# Altium project H05R1.PrjPcb (part 2 of 2)

## Sheet H05R1_Frontend_1.SchDoc
size Letter; CompanyName: Hexabitz; DocumentNumber: 3; SheetNumber: 2; SheetTotal: 3
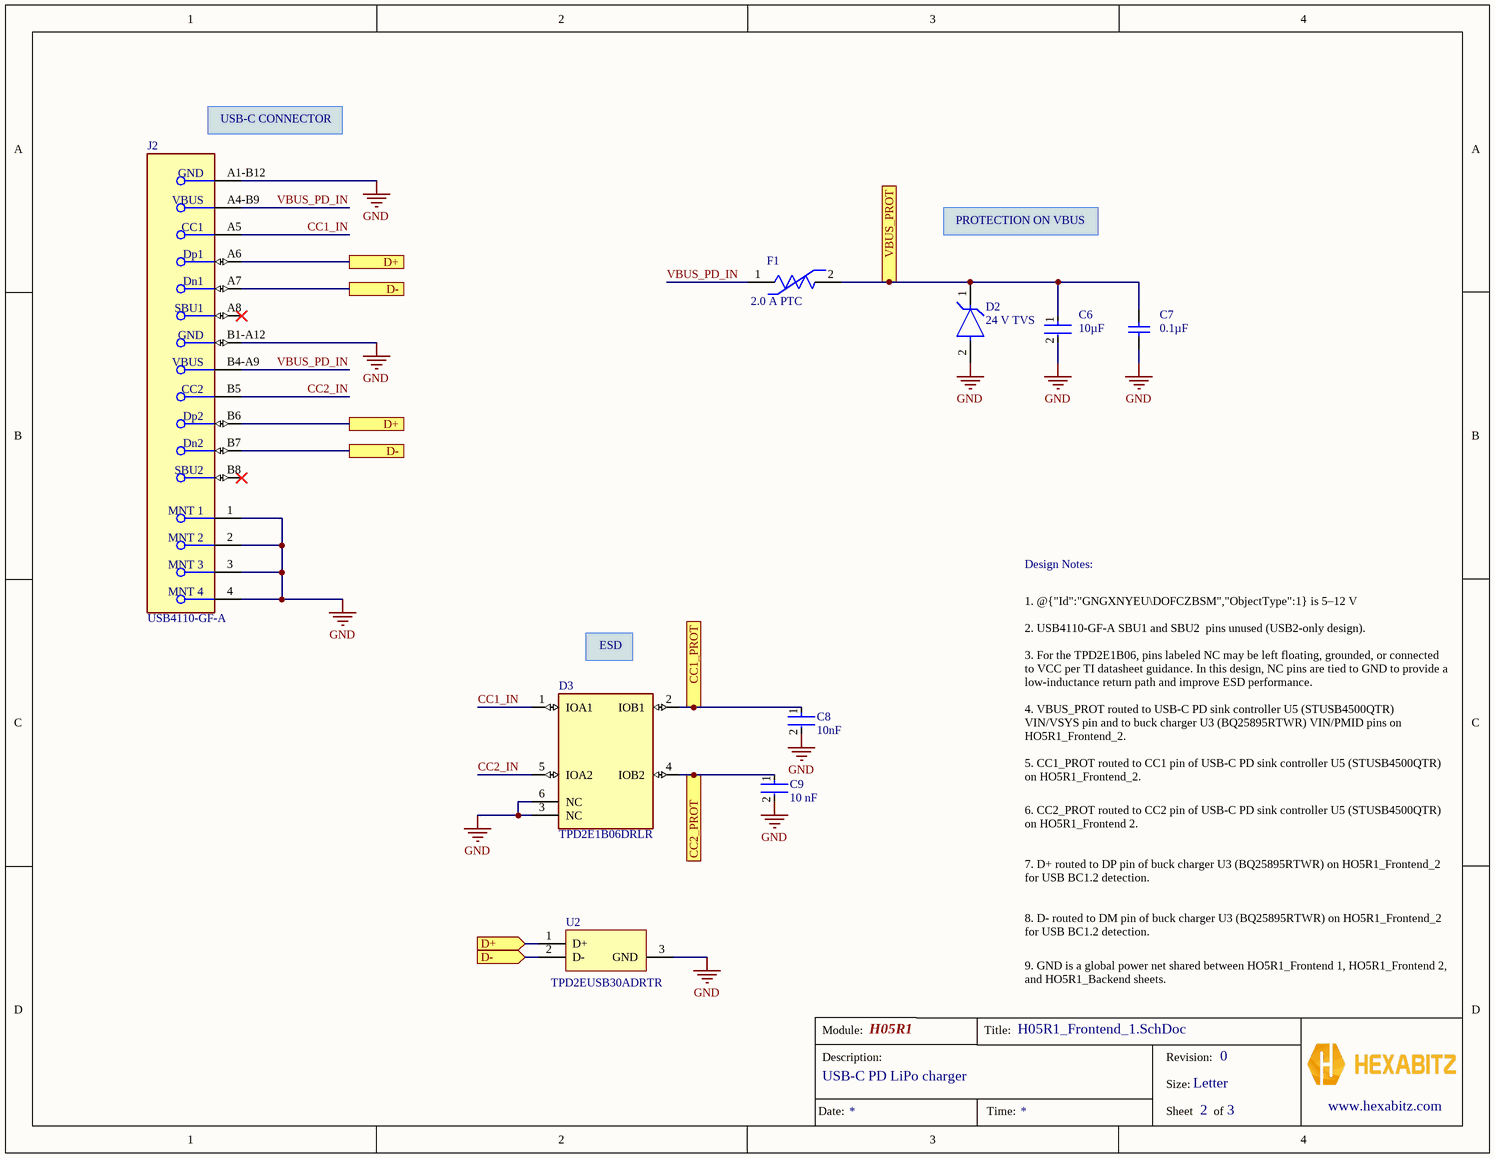
[diagram p1: H05R1_Frontend_1.SchDoc]

### Parts
C6  10µF  [FP-GRM32-MFG]
C7  0.1µF  [CAPC1608X90X35ML10T15]
C8  10nF  [FP-GRM155-0_05-IPC_C]
C9  10 nF  [FP-GRM155-0_05-IPC_C]
D2  24 V TVS  [FP-SMBJ-MFG]
D3  TPD2E1B06DRLR  [FP-DRL0006A-MFG]
F1  2.0 A PTC  [FP-0ZCF0200AF2C-MFG]
J2  USB4110-GF-A  [FP-USB4110-GF-A-MFG]
U2  TPD2EUSB30ADRTR  [DRT0003A]

### Ports
CC1_PROT, CC2_PROT, D+, D+ (in), D-, D- (in), VBUS_PROT

### Nets
GND: C6.2 C7.1 C8.2 C9.2 D2.2(A) D3.3(NC) D3.6(NC) J2.1(MNT_1) J2.2(MNT_2) J2.3(MNT_3) J2.4(MNT_4) J2.A1-B12(GND) J2.B1-A12(GND) U2.3(GND)  [project net PGND]
CC1_IN: D3.1(IOA1) J2.A5(CC1)
CC2_IN: D3.5(IOA2) J2.B5(CC2)
VBUS_PD_IN: F1.1 J2.A4-B9(VBUS) J2.B4-A9(VBUS)
NetC6_1: C6.1 C7.2 D2.1(C) F1.2 ; port VBUS_PROT
NetC8_1: C8.1 D3.2(IOB1) ; port CC1_PROT
NetC9_1: C9.1 D3.4(IOB2) ; port CC2_PROT
NetJ2_A6: J2.A6(Dp1) J2.B6(Dp2) U2.1(D+) ; port D+
NetJ2_A7: J2.A7(Dn1) J2.B7(Dn2) U2.2(D-) ; port D-

Not connected (* = marked no-connect by the designer): J2 A8(SBU1)* B8(SBU2)*

### Notes on the sheet
- USB-C CONNECTOR
- PROTECTION ON VBUS
- Design Notes:
- 2. USB4110-GF-A SBU1 and SBU2  pins unused (USB2-only design).
- 1. @{"Id":"GNGXNYEU\DOFCZBSM","ObjectType":1} is 5–12 V from USB-C PD source.
- ESD
- 3. For the TPD2E1B06, pins labeled NC may be left floating, grounded, or connected to VCC per TI datasheet guidance. In this design, NC pins are tied to GND to provide a low-inductance return path and improve ESD performance.
- 4. VBUS_PROT routed to USB-C PD sink controller U5 (STUSB4500QTR) VIN/VSYS pin and to buck charger U3 (BQ25895RTWR) VIN/PMID pins on HO5R1_Frontend_2.
- 5. CC1_PROT routed to CC1 pin of USB-C PD sink controller U5 (STUSB4500QTR) on HO5R1_Frontend_2.
- 6. CC2_PROT routed to CC2 pin of USB-C PD sink controller U5 (STUSB4500QTR) on HO5R1_Frontend 2.
- 7. D+ routed to DP pin of buck charger U3 (BQ25895RTWR) on HO5R1_Frontend_2 for USB BC1.2 detection.
- 8. D- routed to DM pin of buck charger U3 (BQ25895RTWR) on HO5R1_Frontend_2 for USB BC1.2 detection.
- 9. GND is a global power net shared between HO5R1_Frontend 1, HO5R1_Frontend 2, and HO5R1_Backend sheets.
- Module:
- Title:
- Description:
- Size:
- Revision:
- Letter
- www.hexabitz.com
- Date:
- Time:
- Sheet
- of

### Library data of the parts
C6 = CMP-2000-05261-2: CAP CER 10UF 50V X7R 1210; Manufacturer Part Number: GRM32ER71H106KA12L; Manufacturer: Murata; Tolerance: 10%; Material: Ceramic; Temperature Coefficient: 15%; Voltage Rating: 50V; Temperature Characteristic: X7R; Value: 10uF; ComponentLink2Description: Datasheet; Device Class L1: Passive Components; Lead Free: Yes; Temperature Range High: +125°C; Category: Cap; ComponentLink2URL: https://search.murata.co.jp/Ceramy/image/img/A01X/G101/ENG/GRM32ER71H106KA12-01.pdf; Device Class L2: Capacitors; Package: GRM32; Mouser Description: 1210 10 uF 50 V ±10% Tolerance X7R SMT Multilayer Ceramic Capacitor; Capacitance: 10uF; Octopart: https://octopart.com/grm32er71h106ka12l-murata-10470987; Digikey Description: CAP CER 10UF 50V X7R 1210; Height: 2.7mm; Temperature: -55°C to +125°C; Temperature Range Low: -55°C; RoHS: TRUE; Device Class L3: Ceramic Capacitors; Automotive: No; MPN: *; Octopartt: https://octopart.com/grm32er71h106ka12l-murata-10470987
C7 = CMP-2100-03643-1: Chip Capacitor, 0.1 uF, +/- 10%, 50 V, -55 to 125 degC, 0603 (1608 Metric), RoHS, Tape and Reel; Manufacturer: Murata; Dielectric Material: Ceramic; Voltage Rating: 50V; Capacitance: 100nF; Dielectric: X7R; Insulation Resistance: 10GR; Case Code (Metric): 1608; Lead Free: LeadFree; Depth: 0.8mm; Number of Pins: 2; Radiation Hardening: No; Case/Package: 0603; Manufacturer URL: http://www.murata.com/; Packaging: TapeandReel; Length: 1.6mm; Contact Plating: Tin; Datasheet URL: http://psearch.en.murata.com/capacitor/product/GRM188R71H104KA93%23.pdf; Tolerance: 10%; Case Code (Imperial): 0603; Min Operating Temperature: -55degC; RoHSCompliant: true; Voltage: 50V; Termination: SMD/SMT; Mount: SurfaceMount; Material: Ceramic; Package Quantity: 1; Height: 0.8mm; Thickness: 0.035inch; REACH SVHC: NoSVHC; Max Operating Temperature: 125degC; Width: 0.8mm; Package Reference: 0603; Voltage Rating (DC): 50V; Datasheet Version: 42675.0; Package Description: 2-Pin Surface Mount Device, Body 1.6 x 0.8 mm; Octopart: https://octopart.com/part/murata/GRM188R71H104KA93D
C8 = CMP-2008-04637-5: Chip Multilayer Ceramic Capacitors for General Purpose, 0402, 10000pF, X7R, 15%, 10%, 50V; Voltage: 25V; MFN: Murata; Parameter 1: GRM155R71H103KA88D; Tolerance: 10%; Mount: Surface Mount; Lead Free: Lead Free; Radiation Hardening: No; Case Code (Imperial): 0402; REACH SVHC: No SVHC; Case/Package: 0402; Dielectric: X7R; Voltage Rating (DC): 50V; Max Operating Temperature: 125°C; Termination: SMD/SMT; Material: Ceramic; Width: 0.02inch; Package Quantity: 1; Voltage Rating: 50V; Thickness: 0.022inch; Packaging: Tape and Reel; Height: 0.5mm; Number of Pins: 2; Case Code (Metric): 1005; Min Operating Temperature: -55°C; Length: 1mm; Capacitance: 10nF; Depth: 0.5mm; Octopart: https://octopart.com/part/murata/GRM155R71H103KA88D
C9 = CMP-2008-04637-5: Chip Multilayer Ceramic Capacitors for General Purpose, 0402, 10000pF, X7R, 15%, 10%, 50V; MPN: GRM155R71H103KA88D; Voltage: 25V; Capacitance: 10nF; MFN: Murata; Tolerance: 10%; Mount: Surface Mount; Lead Free: Lead Free; Radiation Hardening: No; Case Code (Imperial): 0402; REACH SVHC: No SVHC; Case/Package: 0402; Dielectric: X7R; Voltage Rating (DC): 50V; Max Operating Temperature: 125°C; Termination: SMD/SMT; Material: Ceramic; Width: 0.02inch; Package Quantity: 1; Voltage Rating: 50V; Thickness: 0.022inch; Packaging: Tape and Reel; Height: 0.5mm; Number of Pins: 2; Case Code (Metric): 1005; Min Operating Temperature: -55°C; Length: 1mm; Depth: 0.5mm; Octopart: https://octopart.com/part/murata/GRM155R71H103KA88D
D2 = CMP-07401-000035-1: TVS DIODE 24V 38.9V SMB; MPN: SMBJ24A; Max Breakdown Voltage: 30.7V; Operating Supply Voltage: 3.5V; Min Breakdown Voltage: 26.7V; Test Current: 1mA; Direction: Unidirectional; Peak Pulse Current: 15.4A; Peak Pulse Power: 600W; Number of Unidirectional Channels: 1; Element Configuration: Single; Power Line Protection: No; Diode Type: ZENER; Leakage Current: 5uA; Max Surge Current: 100A; ESD Protection: Yes; MFN: Bourns; Width: 3.94mm; Number of Pins: 2; Clamping Voltage: 38.9V; Reverse Standoff Voltage: 24V; Breakdown Voltage: 30.7V; RoHS Compliant: Yes; Package Quantity: 1; Case/Package: SMB; Mount: Surface Mount; Resistor Type: Zener; Packaging: Tape and Reel; Reverse Breakdown Voltage: 26.7V; Series: SMBJ; Radiation Hardening: No; Max Operating Temperature: 150°C; Termination: SMD/SMT; Number of Channels: 1; Length: 4.57mm; REACH SVHC: No SVHC; Number of Elements: 1; Polarity: Unidirectional; Height: 2.42mm; Max Power Dissipation: 600W; Max Reverse Leakage Current: 5uA; Min Operating Temperature: -55°C; ComponentLink1Description: Octopart; ComponentLink1URL: https://octopart-clicks.com/click/altium?manufacturer=Bourns&mpn=SMBJ24A&country=US&channel=Vault+Part+Catalog&ref=man&; Octopart: https://octopart.com/smbj24a-bourns-12809467
D3 = CMP-04985-000003-1: TVS DIODE 5.5V 15V 6SOT; Manufacturer: Texas Instruments; Peak Pulse Power: 35W; Peak Pulse Current: 2.5A; Direction: Bidirectional; Standoff Height: 0mm; Interface: I2C,USB,LVDS,Other; Number Of Channels: 2; Breakdown Voltage: 7V; Ambient Temperature Range High: +125°C; Package: DRL0006A; Automotive: No; Lead Free: Yes; Temperature Range Low: -40°C; Reverse Standoff Voltage: 5.5V; Clamping Voltage: 15V; Mouser Description: ESD Suppressors / TVS Diodes 2-CH system level ESD protect device; Temperature Range High: +125°C; Device Class L1: Circuit Protection; ComponentLink2Description: Datasheet; RoHS: TRUE; Ambient Temperature Range Low: -40°C; Height: 0.6mm; Device Class L3: unset; Device Class L2: ESD and Circuit Protection ICs; Temperature: -40°C to +125°C; Octopart: https://octopart.com/tpd2e1b06drlr-texas+instruments-30488860; ComponentLink2URL: http://www.ti.com/lit/ds/symlink/tpd2e1b06.pdf; Category: Diode; Manufacturer Part Number: TPD2E1B06DRLR; Digikey Description: TVS DIODE 5.5V 15V 6SOT
F1 = CMP-16043-000006-1: PTC RESET FUSE 24V 2A 2920; MPN: 0ZCF0200AF2C; Max Current Rating: 40A; Trip Current: 4A; Time to Trip: 5s; MFN: Bel Fuse; Package Quantity: 1; Packaging: Cut Tape; Case Code (Metric): 7351; Case Code (Imperial): 2920; Hold Current: 2A; Lead Free: Lead Free; ComponentLink1Description: Octopart; ComponentLink1URL: https://octopart-clicks.com/click/altium?manufacturer=Bel+Fuse&mpn=0ZCF0200AF2C&country=US&channel=Vault+Part+Catalog&ref=man&
J2 = CMP-245163-000002-1: CONN USB 2.0 TYPE-C R/A SMT; Manufacturer: GCT; Conn Orientation: Right Angle; Usb Standard: USB 2.0; Voltage Rating: 20V; Current Rating: 3/4.25/1.25/0.25A; Number Of Contacts: 16; Is Female: yes; Shielding: true; Standoff Height: 0.1mm; Octopart: https://octopart.com/usb4110-gf-a-gct-103941985; Temperature: -40°C to +85°C; RoHS: TRUE; Automotive: No; Contact Material: Gold,Nickel; Device Class L1: Connectors; Device Class L2: USB Connectors; Package: 0; Lead Free: Yes; ComponentLink2URL: https://gct.co/files/drawings/usb4110.pdf; Temperature Range High: +85°C; Temperature Range Low: -40°C; Height: 3.46mm; Manufacturer Part Number: USB4110-GF-A; ComponentLink2Description: Datasheet; Device Class L3: unset; Digikey Description: CONN USB 2.0 TYPE-C R/A SMT; Category: Conn; MPN: USB4110-GF-A
U2 = CMP-0326-00047-3: ESD / Surge Solution for High Speed, Low Voltage Interface, 2 Channels, -40 to +85 degC, 3-pin SOT (DRT), Green (RoHS & no Sb/Br); Manufacturer: Texas Instruments; IEC 61000-4-2 Air-Gap(+/- kV): 8; SubFamily: ESD Solution; 1394 / Firewire: TRUE; IO Leakage Current(nA): 10; Differential Capacitance(pF): 0.05; Breakdown Voltage(Min)(V): 4.5; IO Capacitance(Typ)(pF): 0.7; Mounting Technology: Surface Mount; PartNumber: TPD2EUSB30ADRTR; ComponentLink2URL: SamplesURL:http://www.ti.com/product/tpd2eusb30a#samples; IEC 61000-4-2 Contact(+/- kV): 8; PackageReference: DRT0003A; Eco-Plan: Green (RoHS & no Sb/Br); ComponentLink2Description: URL Link1; USB Full Speed: TRUE; USB High Speed: TRUE; PackageDescription: 3-Flat Lead Plastic Small Outline, 1 x 1 mm (inc leads), 0.35 mm Pitch; Serial ATA / eSATA: TRUE; ComponentLink1URL: http://www.ti.com/general/docs/lit/getliterature.tsp?genericPartNumber=TPD2EUSB30A&fileType=pdf; DatasheetVersion: SLVSAC2C; PackageVersion: revD, Jun-2008; ComponentLink1Description: Datasheet; HDMI: TRUE; USB Super Speed: TRUE; Octopart: https://octopart.com/tpd2eusb30adrtr-texas+instruments-19659288

## Sheet H05R1_Frontend_2.SchDoc
size Letter; CompanyName: Hexabitz; DocumentNumber: 3; SheetNumber: 3; SheetTotal: 3
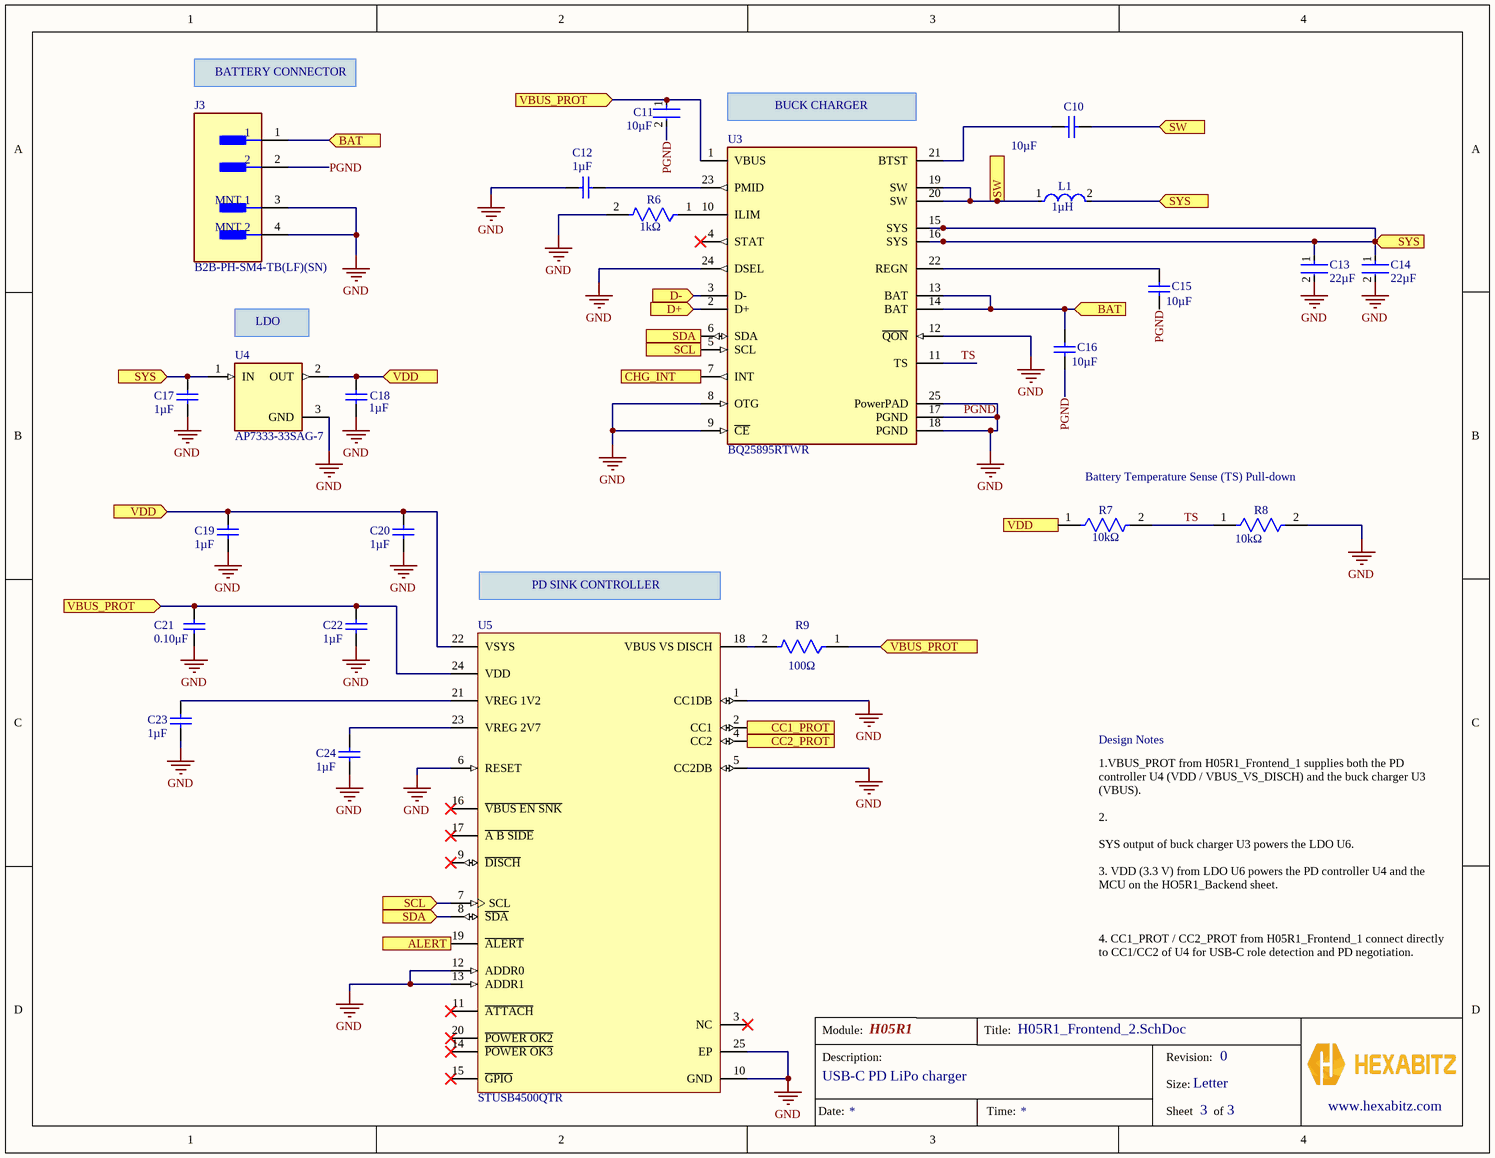
[diagram p2: H05R1_Frontend_2.SchDoc]

### Parts
C10  10µF  [CAPC1608X90X35ML10T15]
C11  10µF  [FP-GRM21B-0_2-e0_2_0_7-IPC_B]
C12  1µF  [CAPC1608X90X35ML10T15]
C13  22µF  [FP-GRM21B-0_15-MFG]
C14  22µF  [FP-GRM21B-0_15-MFG]
C15  10µF  [CAPC1608X90X35ML10T15]
C16  10µF  [CAPC2013X135X45ML10T25]
C17  1µF  [CAPC1608X90X35ML10T15]
C18  1µF  [CAPC1608X90X35ML10T15]
C19  1µF  [MURA-0603_H_0.9_M]
C20  1µF  [CAPC1608X90X35ML10T15]
C21  0.10μF  [CAPC1608X90X35LL10T15]
C22  1µF  [CAPC1608X90X35ML10T15]
C23  1µF  [CAPC1608X90X35ML10T15]
C24  1µF  [CAPC1608X90X35ML10T15]
J3  B2B-PH-SM4-TB(LF)(SN)  [FP-B2B-PH-SM4-TB_LF_SN-MFG]
L1  1µH  [FP-XAL4020-102MEC-MFG]
R6  1kΩ  [FP-RC0603-0_55-IPC_C]
R7  10kΩ  [FP-RC0603-0_55-IPC_C]
R8  10kΩ  [FP-RC0603-0_55-IPC_C]
R9  100Ω  [FP-RC0603-0_55-MFG]
U3  BQ25895RTWR  [FP-RTW0024H-IPC_B]
U4  AP7333-33SAG-7  [FP-SOT23-MFG]
U5  STUSB4500QTR  [FP-QFN-24-EP_4x4-MFG]

### Ports
ALERT (in), BAT (in), CC1_PROT (in), CC2_PROT (in), CHG_INT (in), D+ (in), D- (in), SCL (in), SDA (in), SW (in), SYS (in), VBUS_PROT (in), VDD (in)

### Nets
PGND: C11.2 C12.1 C13.2 C14.2 C15.1 C16.1 C17.1 C18.1 C19.1 C20.1 C21.1 C22.1 C23.1 C24.1 J3.2 J3.3(MNT_1) J3.4(MNT_2) R6.2 R8.2 U3.8(OTG) U3.9(~{CE}) U3.12(~{QON}) U3.17(PGND) U3.18(PGND) U3.24(DSEL) U3.25(PowerPAD) U4.3(GND) U5.1(CC1DB) U5.5(CC2DB) U5.6(RESET) U5.10(GND) U5.12(ADDR0) U5.13(ADDR1) U5.25(EP)  [also labelled GND]
TS: R7.2 R8.1 U3.11(TS)
NetC6_1: C11.1 C21.2 C22.2 R9.1 U3.1(VBUS) U5.24(VDD) ; port VBUS_PROT
NetC8_1: U5.2(CC1) ; port CC1_PROT
NetC9_1: U5.4(CC2) ; port CC2_PROT
NetC10_1: C10.1 L1.1 U3.19(SW) U3.20(SW) ; port SW
NetC10_2: C10.2 U3.21(BTST)
NetC12_2: C12.2 U3.23(PMID)
NetC13_1: C13.1 C14.1 C17.2 L1.2 U3.15(SYS) U3.16(SYS) U4.1(IN) ; port SYS
NetC15_2: C15.2 U3.22(REGN)
NetC16_2: C16.2 J3.1 U3.13(BAT) U3.14(BAT) ; port BAT
NetC18_2: C18.2 C19.2 C20.2 R7.1 U4.2(OUT) U5.22(VSYS) ; port VDD
NetC23_2: C23.2 U5.21(VREG_1V2)
NetC24_2: C24.2 U5.23(VREG_2V7)
NetJ2_A6: U3.2(D+) ; port D+
NetJ2_A7: U3.3(D-) ; port D-
NetR1_1: U3.5(SCL) U5.7(SCL) ; port SCL
NetR2_1: U3.6(SDA) U5.8(~{SDA}) ; port SDA
NetR6_1: R6.1 U3.10(ILIM)
NetR9_2: R9.2 U5.18(VBUS_VS_DISCH)
NetU1_15: U3.7(INT) ; port CHG_INT
NetU1_16: U5.19(~{ALERT}) ; port ALERT

Not connected (* = marked no-connect by the designer): U3 4(STAT)*; U5 3(NC)* 9(~{DISCH})* 11(~{ATTACH})* 14(~{POWER_OK3})* 15(~{GPIO})* 16(~{VBUS_EN_SNK})* 17(~{A_B_SIDE})* 20(~{POWER_OK2})*

### Notes on the sheet
- BATTERY CONNECTOR
- (near U3) BUCK CHARGER
- (near U4) LDO
- Battery Temperature Sense (TS) Pull-down
- PD SINK CONTROLLER
- Design Notes
- 1.VBUS_PROT from H05R1_Frontend_1 supplies both the PD controller U4 (VDD / VBUS_VS_DISCH) and the buck charger U3 (VBUS).
  2.
  SYS output of buck charger U3 powers the LDO U6.
  3. VDD (3.3 V) from LDO U6 powers the PD controller U4 and the MCU on the HO5R1_Backend sheet.
  4. CC1_PROT / CC2_PROT from H05R1_Frontend_1 connect directly to CC1/CC2 of U4 for USB-C role detection and PD negotiation.
  5. SDA, SCL, ALERT (U4), and CHG_INT (U3) are routed to the MCU within HO5R1_Backend to enable PD control and charger status monitoring.
- Module:
- Title:
- Description:
- Size:
- Revision:
- Letter
- www.hexabitz.com
- Date:
- Time:
- Sheet
- of

### Library data of the parts
C10 = CMP-2006-02858-1: Ceramic Capacitor, Multilayer, Ceramic, 25V, 10% +Tol, 10% -Tol, X7R, 15% TC, 10uF, Surface Mount, 0805; Part Number: GRM188R71C473KA01D; Manufacturer: Murata; Octopart: https://octopart.com/part/murata/GRM21BZ71E106KE15L
C11 = CMP-06035-047417-1: Chip Multilayer Ceramic Capacitors for General Purpose, 0805, 10uF, X7R, 15%, 10%, 25V; MPN: GRM21BZ71E106KE15L; MFN: Murata; Parameter 1: https://octopart.com/part/murata/GRM21BZ71E106KE15L
C12 = CMP-2006-02845-1: Ceramic Capacitor, Ceramic, 16V, 10% +Tol, 10% -Tol, X7R, 15% TC, 1uF, Surface Mount, 0603 / Series: Murata - Chip Monolithic Ceramic Capacitors; Part Number: GRM188R71C105KA12D; Manufacturer: Murata; Octopart: https://octopart.com/search?q=GRM188R71C105KA12D&currency=USD&specs=0
C13 C14 = CMP-2007-03385-2: Chip Multilayer Ceramic Capacitors for General Purpose, 0805, 22uF, X5R, 15%, 20%, 6.3V; MPN: GRM21BR60J226ME39L; MFN: Murata; Material: Ceramic; Max Operating Temperature: 85°C; Voltage: 6.3V; Min Operating Temperature: -55°C; Case/Package: 0805; Thickness: 0.053inch; Dielectric: X5R; Packaging: Tape and Reel; Depth: 1.25mm; Termination: SMD/SMT; Voltage Rating (DC): 6.3V; Radiation Hardening: No; Tolerance: 20%; Mount: Surface Mount; Lead Free: Lead Free; Package Quantity: 1; REACH SVHC: No SVHC; Voltage Rating: 6.3V; Capacitance: 22uF; Length: 2mm; Case Code (Imperial): 0805; Case Code (Metric): 2012; Width: 0.049inch; Height: 1.25mm; Octopart: https://octopart.com/part/murata/GRM21BR60J226ME39L
C15 = CMP-2006-02845-1: Ceramic Capacitor, Multilayer, Ceramic, 25V, 10% +Tol, 10% -Tol, X7R, 15% TC, 10uF, Surface Mount, 0805; Manufacturer: Murata; Part Number: GRM188R71C105KA12D; Octopart: https://octopart.com/part/murata/GRM21BZ71E106KE15L
C16 = CMP-2007-03529-1: Multilayer Ceramic Capacitors MLCC Surface Mount 0805 10uF 6.3 Volts X5R; Part Number: GRM21BR60J106KE19L; Manufacturer: Murata; Octopart: https://octopart.com/search?q=GRM21BR60J106KE19L&currency=USD&specs=0
C17 C18 C20 = CMP-2006-02845-1: Ceramic Capacitor, Ceramic, 16V, 10% +Tol, 10% -Tol, X7R, 15% TC, 1uF, Surface Mount, 0603; Manufacturer: Murata; Part Number: GRM188R71C105KA12D; Octopart: https://octopart.com/part/murata/GRM188R71C105KA12D
C19 = CMP-2000-05253-1: CAP, Ceramic, 0.1 uF, 10%, 16 V, 0603, RoHS, Tape and Reel; Manufacturer: Murata; MPN: GRM188R71C104KA01D; Capacitance - pF: 100000pF; Case Length: 1.6mm; Voltage Rating DC: 16V; Brand: MurataElectronics; Temperature Coefficient / Code: +/-15%; Case Width: 0.8mm; Type: GeneralPurposeMLCC; Capacitance: 0.1uF; Dielectric: X7R; Capacitance - nF: 100nF; Product Category: MultilayerCeramicCapacitorsMLCC-SMD/SMT; Datasheet URL: https://datasheet.ciiva.com/29202/451467-da-01-en-vs-kondensator-0603-29202287.pdf; Termination Style: SMD/SMT; Operating Temperature Range: -55Cto+125C; Case Code - in: 0603; Datasheet Version: Dec-10; Dimensions: 0.8mmWx1.6mmLx0.8mmH; RoHS: Details; Case Code - mm: 1608; Product: GeneralTypeMLCCs; Voltage Rating: 16V; Package / Case: 0603(1608metric); Factory Pack Quantity: 4000; Packaging: Reel; Maximum Operating Temperature: +125C; Manufacturer URL: http://www.murata.com/; Case Height: 0.8mm; Minimum Operating Temperature: -55C; Series: GRM; Tolerance: 10%; Octopart: https://octopart.com/part/murata/GRM188R71C104KA01D
C21 = CMP-2006-02868-1: 25V 100Nf X7R 10% 0603 Multilayer Ceramic Capacitors Mlcc Smd/Smt Rohs; Part Number: GRM188R71E104KA01D; Manufacturer: Murata
C22 = CMP-2006-02460-1: Manufacturer: Murata; Part Number: GRM188R71E105KA12D; Octopart: https://octopart.com/part/murata/GRM188R71E105KA12D
C23 C24 = CMP-2006-02460-1: Ceramic Capacitor, Ceramic, 25V, 10% +Tol, 10% -Tol, X7R, 15% TC, 1uF, Surface Mount, 0603; Manufacturer: Murata; Part Number: GRM188R71E105KA12D; Octopart: https://octopart.com/part/murata/GRM188R71E105KA12D
J3 = CMP-2000-05163-2: CONN HEADER SMD 2POS 2MM; Number of Poles: 2; Max Current Rating: 2A; Gender: Male; Working Voltage: 100V; Mated Stacking Heights: 8.6mm; Contact Resistance: 20mR; Insulation Resistance: 1GR; MFN: JST; Number of Contacts: 2; Housing Material: Polyamide; Lead Pitch: 2mm; Packaging: Tape and Reel; Fastening Type: Detent; Contact Finish - Mating: TIN; Width: 5.5mm; Min Operating Temperature: -25°C; Mount: Surface Mount; Current Rating: 2A; Pitch: 2mm; REACH SVHC: No SVHC; Flammability Rating: UL94 V-0; Contact Plating: Tin; Voltage Rating (AC): 100V; Length: 7.95mm; Number of Rows: 1; Max Operating Temperature: 85°C; Connector Type: Header; Height: 9.4mm; Insulation Material: Nylon; Depth: 5mm; Color: White; Termination: Solder; Housing Color: Beige; Contact Mating Length: 0.13inch; Contact Material: Copper Alloy; Orientation: Straight; Contact Type: Male Pin; Lead Free: Lead Free; Voltage Rating: 100V; Series: PH; Number of Positions: 2; Contact Shape: Square; Max Voltage Rating (AC): 100V; Insulation Color: Natural; Octopart: https://octopart.com/part/jst/B2B-PH-SM4-TB%28LF%29%28SN%29; MPN: B2B-PH-SM4-TB(LF)(SN)
L1 = CMP-11268-000037-1: Fixed Inductors 1uH 20% 9.6A 14.60mOhms AEC-Q200; Manufacturer: Coilcraft; Manufacturer Part Number: XAL4020-102MEC; Saturation Current: 8.7A; Core Material: Composite; Test Frequency: 1MHz; Standoff Height: 0.1mm; Shielding: true; Automotive Grade: Grade 1; Self Resonant Frequency: 79MHz; Series Resistance: 14.6mΩ; Rms Current: 9.6A; Category: Ind; RoHS: TRUE; Device Class L2: Inductors; Mouser Description: Power inductor, shielded, 20% tol, SMT, RoHS, halogen f; Lead Free: Yes; Device Class L1: Passive Components; Inductance: 1uH; ComponentLink2URL: https://www.coilcraft.com/pdfs/xal4000.pdf; Height: 2.1mm; Device Class L3: Fixed Inductors; Composition: Wirewound; Package: 0; Ambient Temperature Range Low: -40°C; Automotive: Yes; Ambient Temperature Range High: +125°C; ComponentLink2Description: Datasheet; Octopart: https://octopart.com/xal4020-102mec-coilcraft-13142161; Tolerance: 20%; Value: 1uH
R6 = CMP-1659-00009-5: RES 1K OHM 1% 1/10W 0603; MPN: RC0603FR-071KL; Resistance: 1kR; Voltage Rating: 50V; Power Rating: 100mW; Temperature Coefficient: 100ppm/°C; MFN: Yageo Group; Military Standard: Not; REACH SVHC: No SVHC; Size Code: 0603; Features: Moisture Resistant; Number of Terminations: 2; Technology: THICK FILM; Series: RC; Case Code (Metric): 1608; Resistance Tolerance: 1%; Resistor Type: Thick Film; Termination: SMD/SMT; Contact Plating: Tin; Radiation Hardening: No; Min Operating Temperature: -55°C; Max Operating Temperature: 155°C; Packaging: Tape and Reel; Max Power Dissipation: 100mW; RoHS Compliant: Yes; Height: 0.45mm; Lead Free: Lead Free; Case/Package: 0603; Length: 1.6mm; Tolerance: 1%; Case Code (Imperial): 0603; Construction: Rectangular; Depth: 0.8mm
R7 R8 = CMP-2100-03664-2: RES 10K OHM 1% 1/10W 0603; MPN: RC0603FR-0710KL; Voltage Rating: 75V; Voltage Rating (DC): 50V; Resistance: 10kR; Power Rating: 100mW; Temperature Coefficient: 100ppm/°C; MFN: Yageo Group; Depth: 0.8mm; Termination: SMD/SMT; Resistor Type: Thick Film; Series: RC; Construction: Rectangular; Features: Moisture Resistant; Packaging: Tape and Reel; Min Operating Temperature: -55°C; Number of Terminations: 2; Lead Pitch: 0.3mm; RoHS Compliant: Yes; Case/Package: 0603; Resistance Tolerance: 1%; Military Standard: Not; Weight: 7.1E-05oz; Number of Pins: 2; Tolerance: 1%; Length: 1.6mm; Case Code (Imperial): 0603; Lead Free: Lead Free; Width: 0.8mm; Max Power Dissipation: 100mW; Height: 0.45mm; Max Operating Temperature: 155°C; Case Code (Metric): 1608; Size Code: 0603; Octopart: https://octopart.com/search?q=RC0603FR-0710KL&currency=USD&specs=0
R9 = CMP-2100-03663-2: NexarPartId: 55402879; MPN: RC0603FR-07100RL; Voltage Rating: 50V; Power Rating: 100mW; Tolerance: 1%; Temperature Coefficient: 100ppm/°C; MFN: Yageo Group; Case/Package: 0603; Military Standard: Not; REACH SVHC: Unknown; Case Code (Metric): 0603; Max Operating Temperature: 155°C; Schedule B: 8533210045, 8533210045; Height: 450µm; Length: 1.6mm; Lead Free: Lead Free; Packaging: Tape & Reel; Case Code (Imperial): 0603; Composition: Thick Film; Min Operating Temperature: -55°C; Voltage Rating (DC): 50V; RoHS: Compliant; Depth: 800µm; Number of Pins: 2; Termination: SMD/SMT; Width: 800µm; Resistance: 100Ω; Parameter 1: RC0603FR-07100RL
U3 = CMP-04911-000061-1: IC NVDC CHARGER I2C 24WQFN; Output Current: 5A; Number of Cells: 1; Output Voltage: 4.6V; Operating Supply Voltage: 14V; MFN: Texas Instruments; Max Operating Temperature: 85°C; Lead Free: Lead Free; Contact Plating: Gold; RoHS Compliant: Yes; Mount: Surface Mount; Min Operating Temperature: -40°C; MPN: BQ25895RTWR; Octopart: https://octopart.com/bq25895rtwr-texas+instruments-56801238
U4 = CMP-12756-000020-1: IC REG LINEAR 3.3V 300MA SOT23-3; Manufacturer: Diodes Inc.; Number Of Outputs: 1; Max Power Dissipation: 600mW; Max Supply Voltage: 6V; Max Junction Temp: +125°C; Accuracy Percentage: 2%; Dropout Voltage: 300mV; Nominal Supply Current: 55-65uA; Min Supply Voltage: 2V; Output Type: Fixed; Standoff Height: 0.013mm; Ipc Land Pattern Name: SOT92P240X102-3; Output Current: 300mA; Category: IC; Temperature: -40°C to +125°C; Octopart: https://octopart.com/ap7333-33sag-7-diodes+inc.-17947531; Automotive: No; Ambient Temperature Range Low: -40°C; Height: 1.1mm; Lead Free: Yes; Device Class L2: Power Management ICs; Ambient Temperature Range High: +85°C; ComponentLink2Description: Datasheet; Device Class L3: Voltage Regulators - Linear; Mouser Description: AP7333 Series 3.3 V 300 mA SMT Low Dropout Linear Regulator - SOT-23-3; RoHS: TRUE; Footprint Url: https://www.diodes.com/assets/Package-Files/SOT23.pdf; Output Voltage: 3.3V; Device Class L1: Integrated Circuits (ICs); Digikey Description: IC REG LINEAR 3.3V 300MA SOT23-3; Temperature Range High: +125°C; Temperature Range Low: -40°C; Manufacturer Part Number: AP7333-33SAG-7; Package: SOT23; ComponentLink2URL: http://datasheet.octopart.com/AP7333-33SAG-7-Diodes-Inc.-datasheet-11745883.pdf
U5 = CMP-12113-000003-3: 4.1V~22V USB 2.0 I2C Controllers Interface ICs STUSB45 Controller 24-VFQFN Exposed Pad; Number of Ports: 1; Min Supply Voltage: 3V; Max Junction Temperature (Tj): 145°C; Max Supply Voltage: 22V; Interface: I2C, USB; USB Standard: USB 2.0; MFN: STMicroelectronics; Lifecycle Status: Production; Schedule B: 8542390000, 8542390000; Min Operating Temperature: -40°C; Ambient Temperature Range High: 105°C; Max Operating Temperature: 105°C; Height: 1mm; Octopart: https://octopart.com/stusb4500qtr-stmicroelectronics-91765108; MPN: STUSB4500QTR

## Nets that join several sheets
PGND: H05R1_Backend (17 pins), H05R1_Frontend_1 (14 pins), H05R1_Frontend_2 (34 pins)
NetC6_1: H05R1_Frontend_1 (C6.1 C7.2 D2.1 F1.2), H05R1_Frontend_2 (6 pins)
NetC8_1: H05R1_Frontend_1 (C8.1 D3.2), H05R1_Frontend_2 (U5.2)
NetC9_1: H05R1_Frontend_1 (C9.1 D3.4), H05R1_Frontend_2 (U5.4)
NetC18_2: H05R1_Backend (12 pins), H05R1_Frontend_2 (6 pins)
NetJ2_A6: H05R1_Frontend_1 (J2.A6 J2.B6 U2.1), H05R1_Frontend_2 (U3.2)
NetJ2_A7: H05R1_Frontend_1 (J2.A7 J2.B7 U2.2), H05R1_Frontend_2 (U3.3)
NetR1_1: H05R1_Backend (R1.1 U1.17), H05R1_Frontend_2 (U3.5 U5.7)
NetR2_1: H05R1_Backend (R2.1 U1.18), H05R1_Frontend_2 (U3.6 U5.8)
NetU1_15: H05R1_Backend (U1.15), H05R1_Frontend_2 (U3.7)
NetU1_16: H05R1_Backend (U1.16), H05R1_Frontend_2 (U5.19)